# EAGLE design LTC4365-Evaluation (EAGLE 7.5.0)
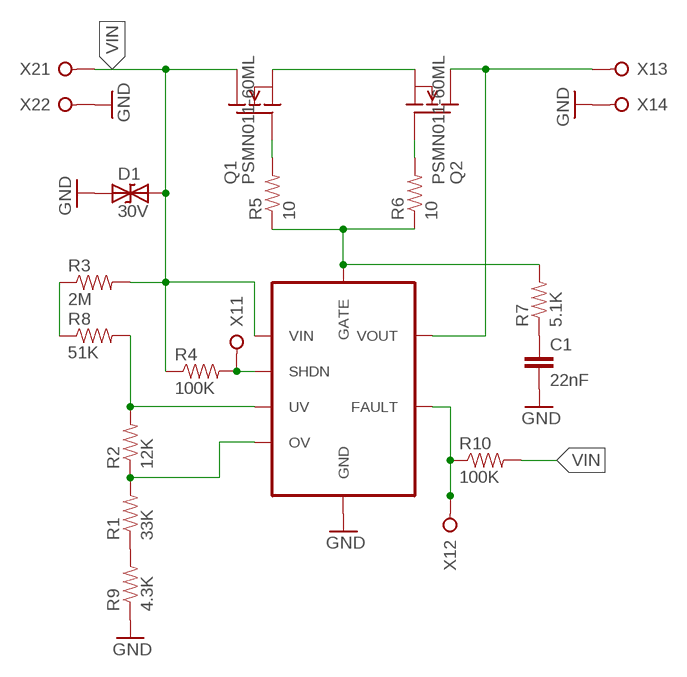
[diagram p0: schematic, sheet 1]

## Parts
C1  22nF  CAPACITOR-0805  [CAPACITOR-0805]
D1  30V  TVS-DO-201  [TVS-DO-201]
IC1  LTC4365  [SOT-23-8]
Q1  PSMN011-60ML  [LFPAK33]
Q2  PSMN011-60ML  [LFPAK33]
R1  33K  RESISTOR-0805  [RESISTOR-0805]
R2  12K  RESISTOR-0805  [RESISTOR-0805]
R3  2M  RESISTOR-0805  [RESISTOR-0805]
R4  100K  RESISTOR-0805  [RESISTOR-0805]
R5  10  RESISTOR-7.5MM  [AXIAL-7.5MM]
R6  10  RESISTOR-0805  [RESISTOR-0805]
R7  5.1K  RESISTOR-0805  [RESISTOR-0805]
R8  51K  RESISTOR-0805  [RESISTOR-0805]
R9  4.3K  RESISTOR-0805  [RESISTOR-0805]
R10  100K  RESISTOR-0805  [RESISTOR-0805]
X1  SCREW-TERM-4  [SCREW-TERM-4]
X2  SCREW-TERM-2  [SCREW-TERM-2]

## Nets
GND: C1.2 D1.1 IC1.4(GND) R9.1 X1.4 X2.2
N$1: Q1.4(GATE) R5.P$2
N$2: Q2.4(GATE) R6.2
N$3: IC1.8(GATE) R5.P$1 R6.1 R7.2
N$5: Q1.1(SRC) Q1.2(SRC) Q1.3(SRC) Q2.1(SRC) Q2.2(SRC) Q2.3(SRC)
N$6: IC1.7(VOUT) Q2.MB(DRN) X1.3
N$7: C1.1 R7.1
N$8: IC1.6(FAULT) R10.1 X1.2
N$9: IC1.5(SHDN) R4.2 X1.1
N$10: R3.1 R8.1
N$11: IC1.2(UV) R2.2 R8.2
N$12: R1.1 R9.2
N$13: IC1.3(OV) R1.2 R2.1
VIN: D1.2 IC1.1(VIN) Q1.MB(DRN) R3.2 R4.1 R10.2 X2.1

## Library data of the parts
C1 = SaintGimp:CAPACITOR-*: Ceramic Capacitor
D1 = SaintGimp:TVS-*
IC1 = SaintGimp:LTC4365: LTC4365 Overvoltage, Undervoltage and Reverse Supply Protection Controller
Q1 Q2 = SaintGimp:PSMN011-60ML: N-MOSFET 60V 11.3 mΩ
R1-R10 = SaintGimp:RESISTOR-*
X1 = SaintGimp:SCREW-TERM-4: 4-Pin Screw Terminal
X2 = SaintGimp:SCREW-TERM-2: 2-Pin Screw Terminal

## Board
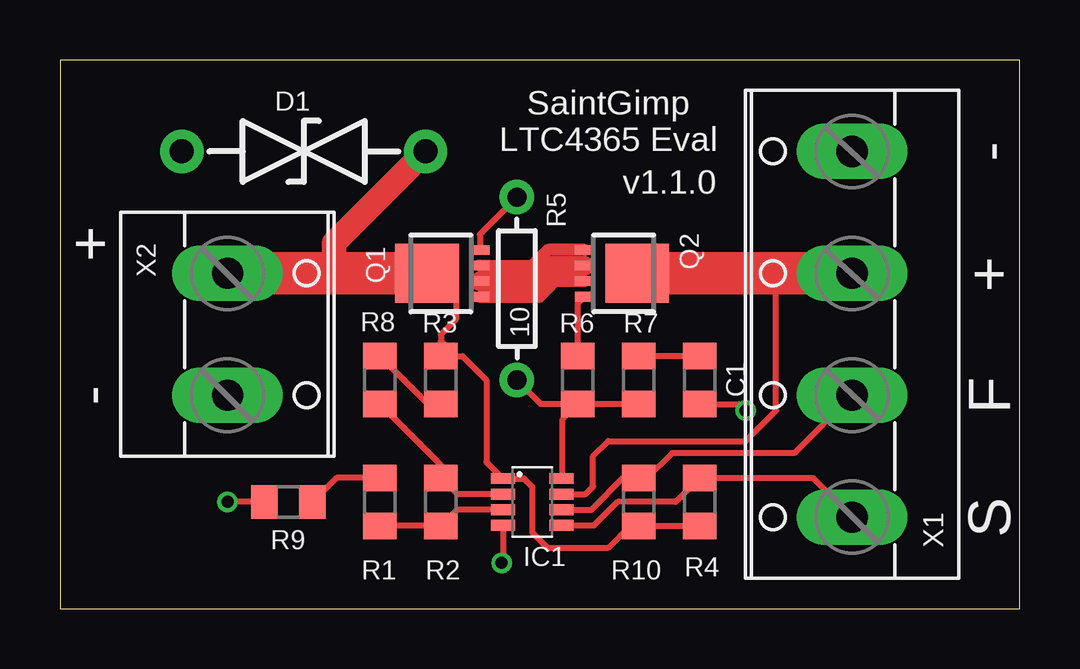
[diagram p1: board, top side]
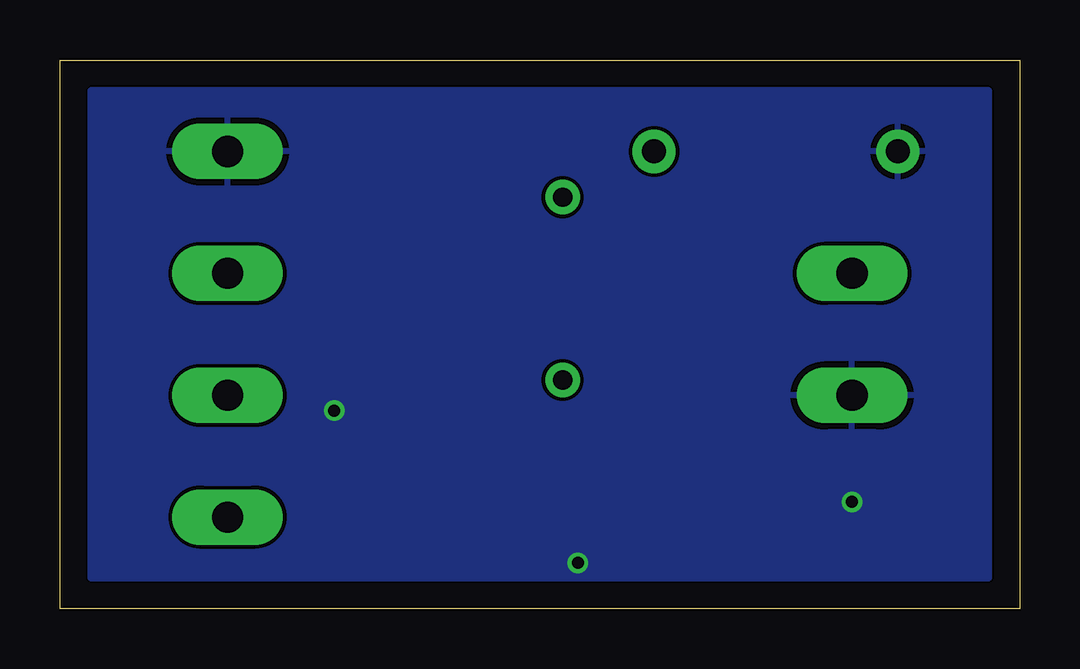
[diagram p2: board, bottom side, seen from below]

Size 40.01 x 22.86 mm. Coordinates in mm from the lower left corner, seen from the top.
Outline: 0,0 40.01,0 40.01,22.86 0,22.86 0,0
Copper layers (1*16): Top 0.0356mm / dielectric 1.5011mm / Bottom 0.0356mm
Design rules "Saintgimp-OSHPark": minimum track width 10mil, minimum drill 13mil, track to track 6mil, track to pad 6mil, pad to pad 6mil, via to via 6mil, smd to smd 6mil, copper to edge 15mil, drill to drill 6mil, minimum pad ring 12mil, minimum via ring 7mil, stop-mask expansion 2mil, vias tented up to drill 24mil, thermal gap 10mil

### Footprints (pad centres in the part's own frame; a part is rotated, then mirrored left to right if it is on the bottom)
CAPACITOR-0805 = smd 1.1 x 1.4: 1 -1,0; 2 1,0
TVS-DO-201 = drill 1: 1 -5.08,0; 2 5.08,0
SOT-23-8 = smd 0.45 x 1: 1 -0.975,-1.225; 2 -0.325,-1.225; 3 0.325,-1.225; 4 0.975,-1.225; 5 0.975,1.225; 6 0.325,1.225; 7 -0.325,1.225; 8 -0.975,1.225
LFPAK33 = smd 0.4 x 0.8: 1 -0.975,-1.625; 2 -0.325,-1.625; 3 0.325,-1.625; 4 0.975,-1.625 | smd 2.45 x 2.65: MB 0,0.575
RESISTOR-0805 = smd 1.1 x 1.4: 1 -1,0; 2 1,0
AXIAL-7.5MM = drill 0.8: P$1 -3.81,0; P$2 3.81,0
SCREW-TERM-4 = drill 1.3 long: 1 -7.62,0; 2 -2.54,0; 3 2.54,0; 4 7.62,0
SCREW-TERM-2 = drill 1.3 long: 1 -2.54,0; 2 2.54,0

### Placement (x,y rotation side)
C1  26.67,9.53 270 top
D1  10.16,19.05 0 top
IC1  19.68,4.45 270 top
Q1  15.88,13.97 90 top
Q2  23.5,13.97 270 top
R1  13.34,4.45 270 top
R2  15.88,4.45 90 top
R3  15.88,9.53 90 top
R4  26.67,4.45 90 top
R5  19.05,13.34 90 top
R6  21.59,9.53 90 top
R7  24.13,9.53 270 top
R8  13.34,9.53 270 top
R9  9.53,4.45 0 top
R10  24.13,4.45 270 top
X1  33.02,11.43 90 top
X2  6.99,11.43 270 top

### Tracks (layer width: path | path; a pad name or v marks a point on that pad's centre or on a via)
GND  (via drill 0.5)
  Top 0.254: IC1.4 18.46,1.95 v18.41,1.91 | R9.1 v6.99,4.45 | C1.2 28.3,8.53 v28.57,8.26
  pour Bottom: 1.27,21.59 38.73,21.59 38.73,1.27 1.27,1.27
N$1
  Top 0.254: R5.P$2 17.5,15.6 Q1.4
N$2
  Top 0.254: R6.2 21.59,12.71 Q2.4
N$3
  Top 0.254: IC1.8 20.95,5.46 20.95,7.89 R6.1 | R7.2 R6.1 | R6.1 20.05,8.53 R5.P$1
N$5
  Top 0.508: Q1.3 19.68,14.29 | 19.68,14.29 21.14,14.29 | Q2.3 19.87,13.64 | Q2.1 20.34,14.95 19.68,14.29 | Q1.1 19.98,12.99 20.95,13.97 21.55,13.97 Q2.2
  Top 0.813: Q1.2 19.87,13.64 20.51,14.29 21.14,14.29 Q2.2
N$6
  Top 0.254: IC1.7 21.91,4.77 22.23,5.08 22.23,6.35 22.86,6.99 28.57,6.99 29.84,8.26 29.84,13.97
  Top 1.778: Q2.MB 29.84,13.97 X1.3
N$7
  Top 0.254: C1.1 R7.1
N$8
  Top 0.254: IC1.6 22.15,4.12 23.48,5.45 R10.1 24.5,5.45 25.53,6.48 30.61,6.48 X1.2
N$9
  Top 0.254: IC1.5 22.27,3.47 23.24,4.45 25.67,4.45 R4.2 31.39,5.45 X1.1
N$10
  Top 0.254: R3.1 15.34,8.53 R8.1
N$11
  Top 0.254: 13.43,8.53 R8.2 15.88,5.99 R2.2 16.55,4.77 IC1.2
N$12
  Top 0.254: R1.1 11.53,5.45 R9.2
N$13
  Top 0.254: R1.2 R2.1 16.55,4.12 IC1.3
VIN
  Top 0.254: Q1.MB 16.51,13.91 16.51,12.06 15.88,11.43 15.88,11.16 16.51,10.53 | R3.2 16.51,10.53 | 16.51,10.53 16.78,10.53 17.78,9.53 17.78,6.1 IC1.1 | 18.07,5.42 IC1.1 | R4.1 R10.2 23.77,3.44 22.86,2.54 20.32,2.54 19.68,3.17 19.68,5.08 19.34,5.42 IC1.1
  Top 1.016: D1.2 11.43,15.24 11.43,13.97
  Top 1.778: X2.1 11.43,13.97 Q1.MB

### Text on the board
_tsilk: SaintGimp / LTC4365 Eval | - | v1.1.0 | + | + | - | F | S